# EAGLE design slot (EAGLE 7.1.0)
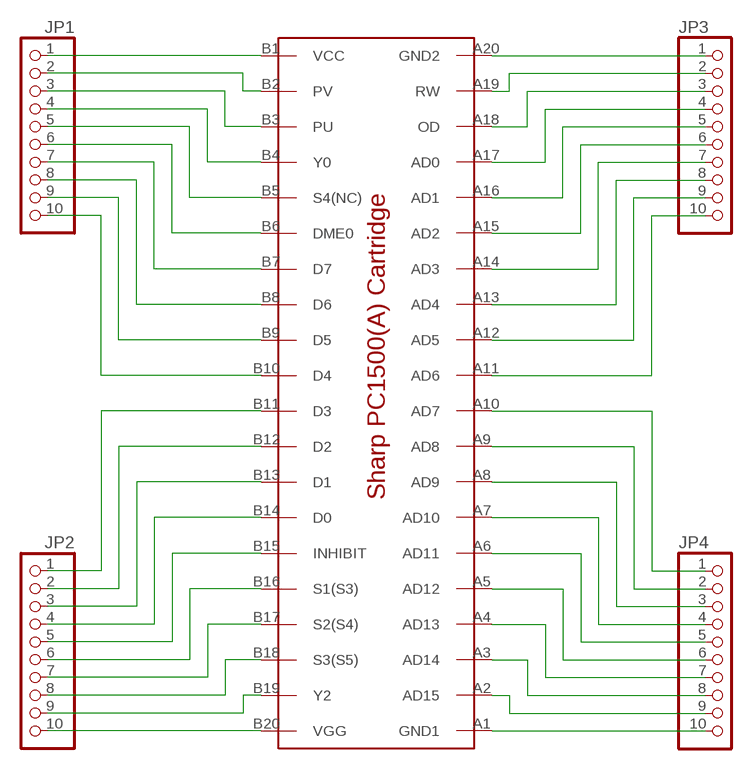
[diagram p0: schematic, sheet 1]

## Parts
JP1  PINHD-1X10  [1X10]
JP2  PINHD-1X10  [1X10]
JP3  PINHD-1X10  [1X10]
JP4  PINHD-1X10  [1X10]
U$1  SHARP-PC1500-SLOT  [SHARP-PC1500-SLOT]

## Nets
N$1: JP2.10 U$1.B20(VGG)
N$2: JP2.9 U$1.B19(Y2)
N$3: JP2.8 U$1.B18(S3(S5))
N$4: JP2.7 U$1.B17(S2(S4))
N$5: JP2.6 U$1.B16(S1(S3))
N$6: JP2.5 U$1.B15(INHIBIT)
N$7: JP2.4 U$1.B14(D0)
N$8: JP2.3 U$1.B13(D1)
N$9: JP2.2 U$1.B12(D2)
N$10: JP2.1 U$1.B11(D3)
N$11: JP1.1 U$1.B1(VCC)
N$12: JP1.2 U$1.B2(PV)
N$13: JP1.3 U$1.B3(PU)
N$14: JP1.4 U$1.B4(Y0)
N$15: JP1.5 U$1.B5(S4(NC))
N$16: JP1.6 U$1.B6(DME0)
N$17: JP1.7 U$1.B7(D7)
N$18: JP1.8 U$1.B8(D6)
N$19: JP1.9 U$1.B9(D5)
N$20: JP1.10 U$1.B10(D4)
N$21: JP3.1 U$1.A20(GND2)
N$22: JP3.2 U$1.A19(RW)
N$23: JP3.3 U$1.A18(OD)
N$24: JP3.4 U$1.A17(AD0)
N$25: JP3.5 U$1.A16(AD1)
N$26: JP3.6 U$1.A15(AD2)
N$27: JP3.7 U$1.A14(AD3)
N$28: JP3.8 U$1.A13(AD4)
N$29: JP3.9 U$1.A12(AD5)
N$30: JP3.10 U$1.A11(AD6)
N$31: JP4.10 U$1.A1(GND1)
N$32: JP4.9 U$1.A2(AD15)
N$33: JP4.8 U$1.A3(AD14)
N$34: JP4.7 U$1.A4(AD13)
N$35: JP4.6 U$1.A5(AD12)
N$36: JP4.5 U$1.A6(AD11)
N$37: JP4.4 U$1.A7(AD10)
N$38: JP4.3 U$1.A8(AD9)
N$39: JP4.2 U$1.A9(AD8)
N$40: JP4.1 U$1.A10(AD7)

## Library data of the parts
JP1-JP4 = pinhead:PINHD-1X10: PIN HEADER
U$1 = sharp-pc:SHARP-PC1500-SLOT: Sharp PC-1500(A) Slot Connector

## Board
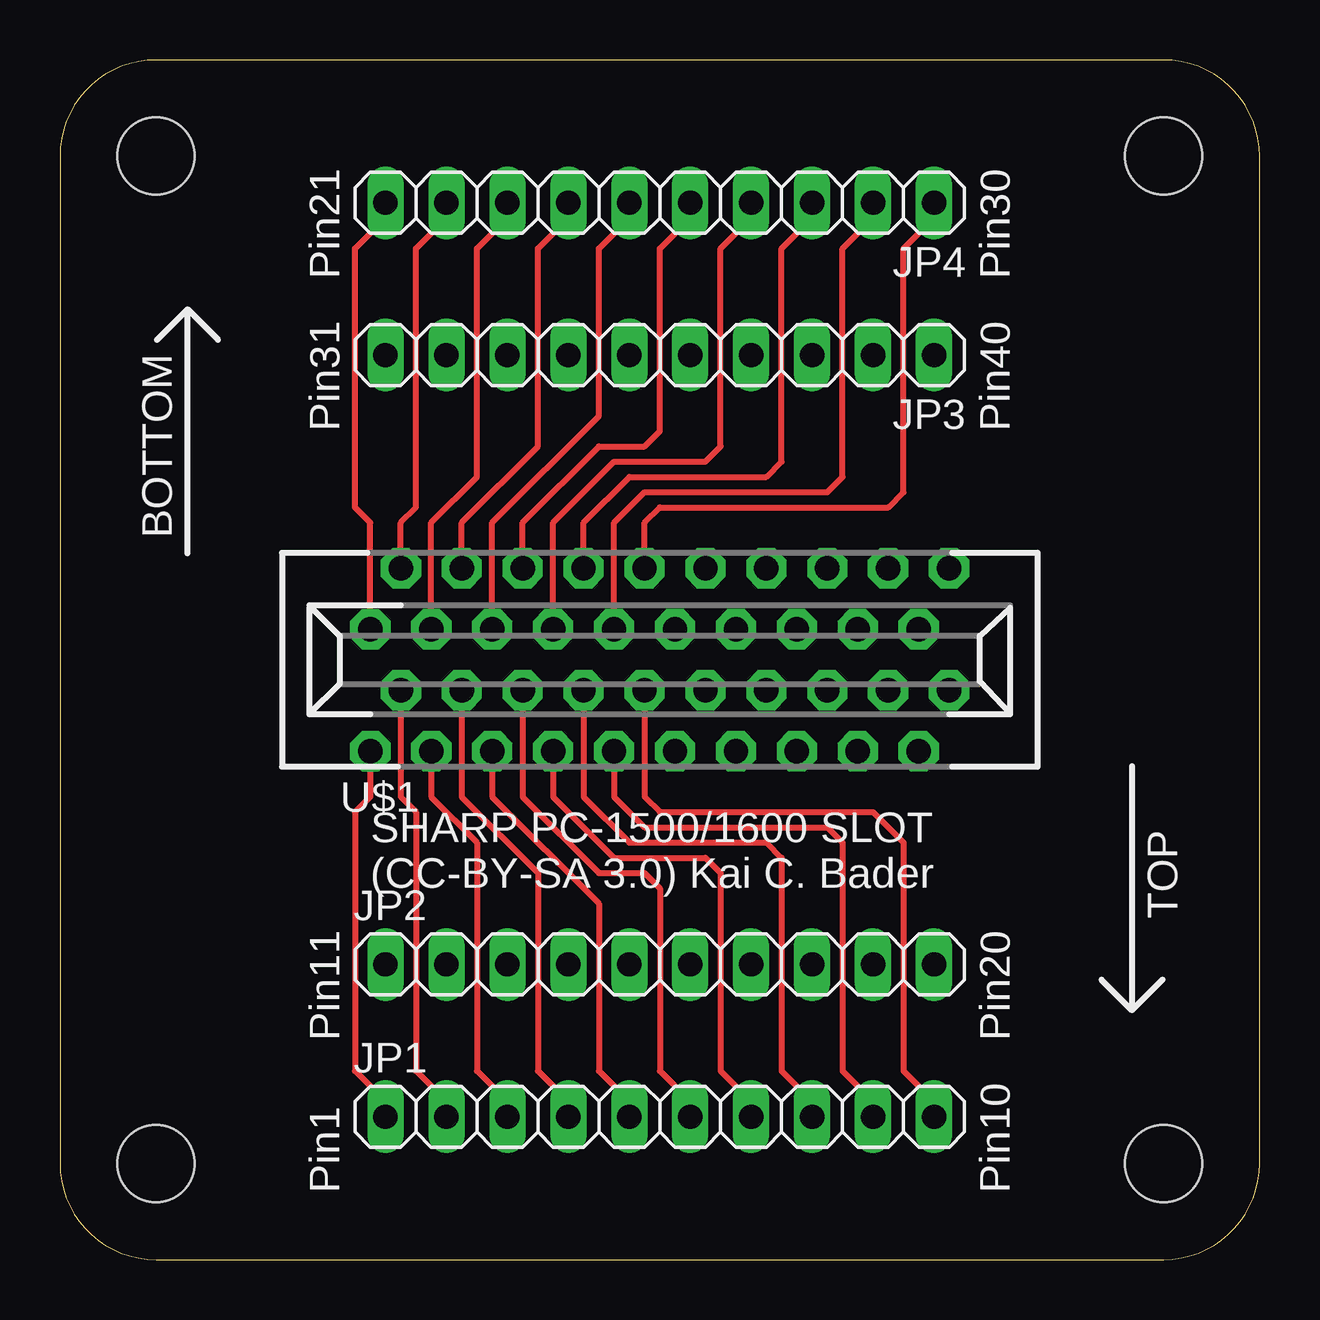
[diagram p1: board, top side]
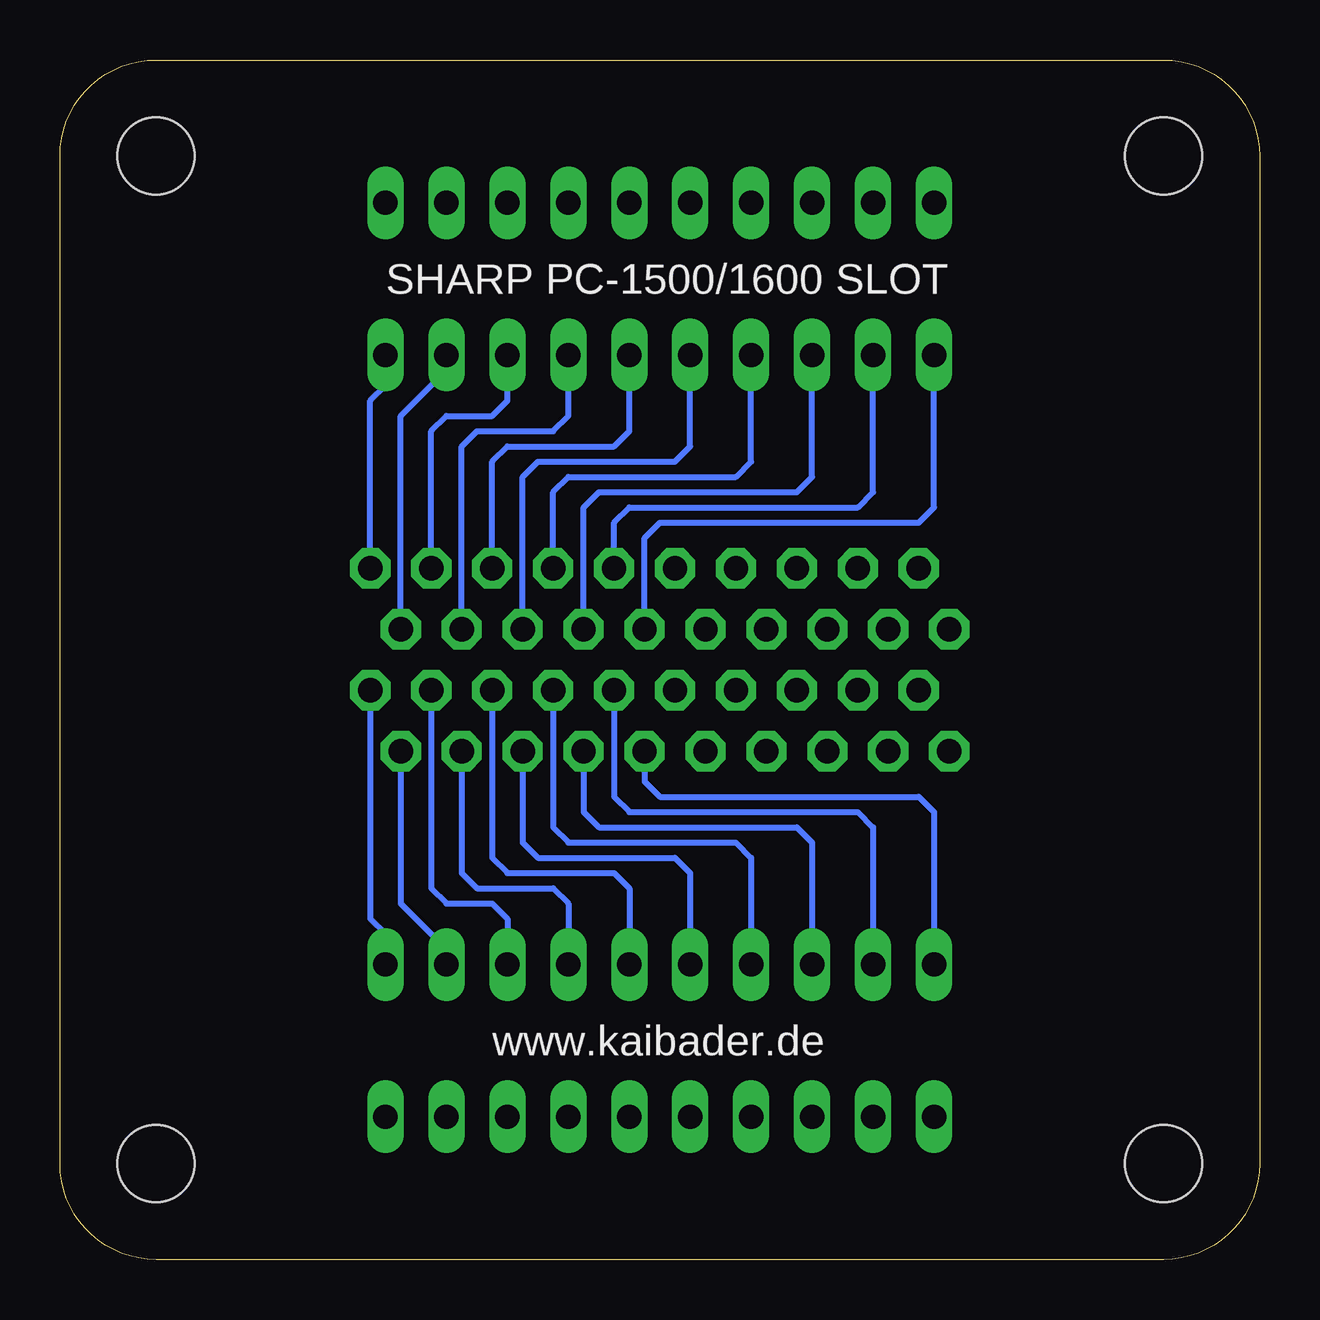
[diagram p2: board, bottom side, seen from below]

Size 50 x 50 mm. Coordinates in mm from the lower left corner, seen from the top.
Copper layers (1*16): Top 0.035mm / dielectric 1.5mm / Bottom 0.035mm
Design rules "ITEADstudio_DRC": minimum track width 6mil, minimum drill 12mil, track to track 6mil, track to pad 6mil, pad to pad 6mil, via to via 6mil, smd to smd 0mil, copper to edge 10mil, drill to drill 10mil, minimum pad ring 10mil, minimum via ring 6mil, stop-mask expansion 2mil, vias tented up to drill 100mil, thermal gap 10mil

### Footprints (pad centres in the part's own frame; a part is rotated, then mirrored left to right if it is on the bottom)
1X10 = drill 1.016 long: 1 -11.43,0; 2 -8.89,0; 3 -6.35,0; 4 -3.81,0; 5 -1.27,0; 6 1.27,0; 7 3.81,0; 8 6.35,0; 9 8.89,0; 10 11.43,0
SHARP-PC1500-SLOT = drill 1.016 pad 1.676 octagon: A1 -12.065,1.27; A2 -10.795,3.81; A3 -9.525,1.27; A4 -8.255,3.81; A5 -6.985,1.27; A6 -5.715,3.81; A7 -4.445,1.27; A8 -3.175,3.81; A9 -1.905,1.27; A10 -0.635,3.81; A11 0.635,1.27; A12 1.905,3.81; A13 3.175,1.27; A14 4.445,3.81; A15 5.715,1.27; A16 6.985,3.81; A17 8.255,1.27; A18 9.525,3.81; A19 10.795,1.27; A20 12.065,3.81; B1 -12.065,-3.81; B2 -10.795,-1.27; B3 -9.525,-3.81; B4 -8.255,-1.27; B5 -6.985,-3.81; B6 -5.715,-1.27; B7 -4.445,-3.81; B8 -3.175,-1.27; B9 -1.905,-3.81; B10 -0.635,-1.27; B11 0.635,-3.81; B12 1.905,-1.27; B13 3.175,-3.81; B14 4.445,-1.27; B15 5.715,-3.81; B16 6.985,-1.27; B17 8.255,-3.81; B18 9.525,-1.27; B19 10.795,-3.81; B20 12.065,-1.27
DP5050_V1 = hole 3.2: -21,-21; 21,-21; 21,21; -21,21

### Placement (x,y rotation side)
JP1  25,5.95 0 top
JP2  25,12.3 0 top
JP3  25,37.7 180 top
JP4  25,44.05 180 top
U$1  25,25 0 top
U$2  [DP5050_V1]  25,25 0 top

### Tracks (layer width: path | path; a pad name or v marks a point on that pad's centre or on a via)
N$1
  Bottom 0.254: U$1.B20 37.07,14.21 36.43,13.57 JP2.10
N$2
  Bottom 0.254: U$1.B19 35.8,14.84 33.89,12.94 JP2.9
N$3
  Bottom 0.254: U$1.B18 34.52,15.48 33.89,14.84 31.98,14.84 31.35,14.21 JP2.8
N$4
  Bottom 0.254: U$1.B17 33.26,16.11 32.62,15.48 29.45,15.48 28.81,14.84 JP2.7
N$5
  Bottom 0.254: U$1.B16 31.98,16.75 31.35,16.11 26.91,16.11 26.27,15.48 JP2.6
N$6
  Bottom 0.254: U$1.B15 30.71,17.38 30.08,16.75 24.37,16.75 23.73,16.11 JP2.5
N$7
  Bottom 0.254: U$1.B14 29.45,18.02 28.81,17.38 21.83,17.38 21.19,16.75 JP2.4
N$8
  Bottom 0.254: U$1.B13 28.18,18.65 27.54,18.02 19.29,18.02 18.65,17.38 JP2.3
N$9
  Bottom 0.254: U$1.B12 26.91,19.29 26.27,18.65 16.75,18.65 16.11,18.02 JP2.2
N$10
  Bottom 0.254: U$1.B11 25.64,19.92 25,19.29 14.21,19.29 13.57,18.65 JP2.1
N$11
  Top 0.254: U$1.B1 12.94,19.29 12.3,18.65 12.3,7.86 13.57,6.59 JP1.1
N$12
  Top 0.254: U$1.B2 14.21,19.29 14.84,18.65 14.84,7.86 16.11,6.59 JP1.2
N$13
  Top 0.254: U$1.B3 15.48,19.29 17.38,17.38 17.38,7.86 18.65,6.59 JP1.3
N$14
  Top 0.254: U$1.B4 16.75,19.29 19.92,16.11 19.92,7.86 21.19,6.59 JP1.4
N$15
  Top 0.254: U$1.B5 18.02,19.29 22.46,14.84 22.46,7.86 23.73,6.59 JP1.5
N$16
  Top 0.254: U$1.B6 19.29,19.29 22.46,16.11 24.37,16.11 25,15.48 25,7.86 26.27,6.59 JP1.6
N$17
  Top 0.254: U$1.B7 20.55,19.29 23.1,16.75 26.91,16.75 27.54,16.11 27.54,7.86 28.81,6.59 JP1.7
N$18
  Top 0.254: U$1.B8 21.83,19.29 23.73,17.38 29.45,17.38 30.08,16.75 30.08,7.86 31.35,6.59 JP1.8
N$19
  Top 0.254: U$1.B9 23.1,19.29 24.37,18.02 31.98,18.02 32.62,17.38 32.62,7.86 33.89,6.59 JP1.9
N$20
  Top 0.254: U$1.B10 24.37,19.29 25,18.65 33.89,18.65 35.16,17.38 35.16,7.86 36.43,6.59 JP1.10
N$21
  Bottom 0.254: U$1.A20 37.07,35.8 36.43,36.43 JP3.1
N$22
  Bottom 0.254: U$1.A19 35.8,35.16 33.89,37.07 JP3.2
N$23
  Bottom 0.254: U$1.A18 34.52,34.52 33.89,35.16 31.98,35.16 31.35,35.8 JP3.3
N$24
  Bottom 0.254: U$1.A17 33.26,33.89 32.62,34.52 29.45,34.52 28.81,35.16 JP3.4
N$25
  Bottom 0.254: U$1.A16 31.98,33.26 31.35,33.89 26.91,33.89 26.27,34.52 JP3.5
N$26
  Bottom 0.254: U$1.A15 30.71,32.62 30.08,33.26 24.37,33.26 23.73,33.89 JP3.6
N$27
  Bottom 0.254: U$1.A14 29.45,31.98 28.81,32.62 21.83,32.62 21.19,33.26 JP3.7
N$28
  Bottom 0.254: U$1.A13 28.18,31.35 27.54,31.98 19.29,31.98 18.65,32.62 JP3.8
N$29
  Bottom 0.254: U$1.A12 26.91,30.71 26.27,31.35 16.75,31.35 16.11,31.98 JP3.9
N$30
  Bottom 0.254: U$1.A11 25.64,30.08 25,30.71 14.21,30.71 13.57,31.35 JP3.10
N$31
  Top 0.254: U$1.A1 12.94,30.71 12.3,31.35 12.3,42.15 13.57,43.41 JP4.10
N$32
  Top 0.254: U$1.A2 14.21,30.71 14.84,31.35 14.84,42.15 16.11,43.41 JP4.9
N$33
  Top 0.254: U$1.A3 15.48,30.71 17.38,32.62 17.38,42.15 18.65,43.41 JP4.8
N$34
  Top 0.254: U$1.A4 16.75,30.71 19.92,33.89 19.92,42.15 21.19,43.41 JP4.7
N$35
  Top 0.254: U$1.A5 18.02,30.71 22.46,35.16 22.46,42.15 23.73,43.41 JP4.6
N$36
  Top 0.254: U$1.A6 19.29,30.71 22.46,33.89 24.37,33.89 25,34.52 25,42.15 26.27,43.41 JP4.5
N$37
  Top 0.254: U$1.A7 20.55,30.71 23.1,33.26 26.91,33.26 27.54,33.89 27.54,42.15 28.81,43.41 JP4.4
N$38
  Top 0.254: U$1.A8 21.83,30.71 23.73,32.62 29.45,32.62 30.08,33.26 30.08,42.15 31.35,43.41 JP4.3
N$39
  Top 0.254: U$1.A9 23.1,30.71 24.37,31.98 31.98,31.98 32.62,32.62 32.62,42.15 33.89,43.41 JP4.2
N$40
  Top 0.254: U$1.A10 24.37,30.71 25,31.35 34.52,31.35 35.16,31.98 35.16,42.15 36.43,43.41 JP4.1

### Text on the board
tPlace: Pin21 | Pin30 | Pin31 | Pin40 | BOTTOM | SHARP PC-1500/1600 SLOT | (CC-BY-SA 3.0) Kai C. Bader | TOP | Pin11 | Pin20 | Pin1 | Pin10
bPlace: SHARP PC-1500/1600 SLOT | www.kaibader.de